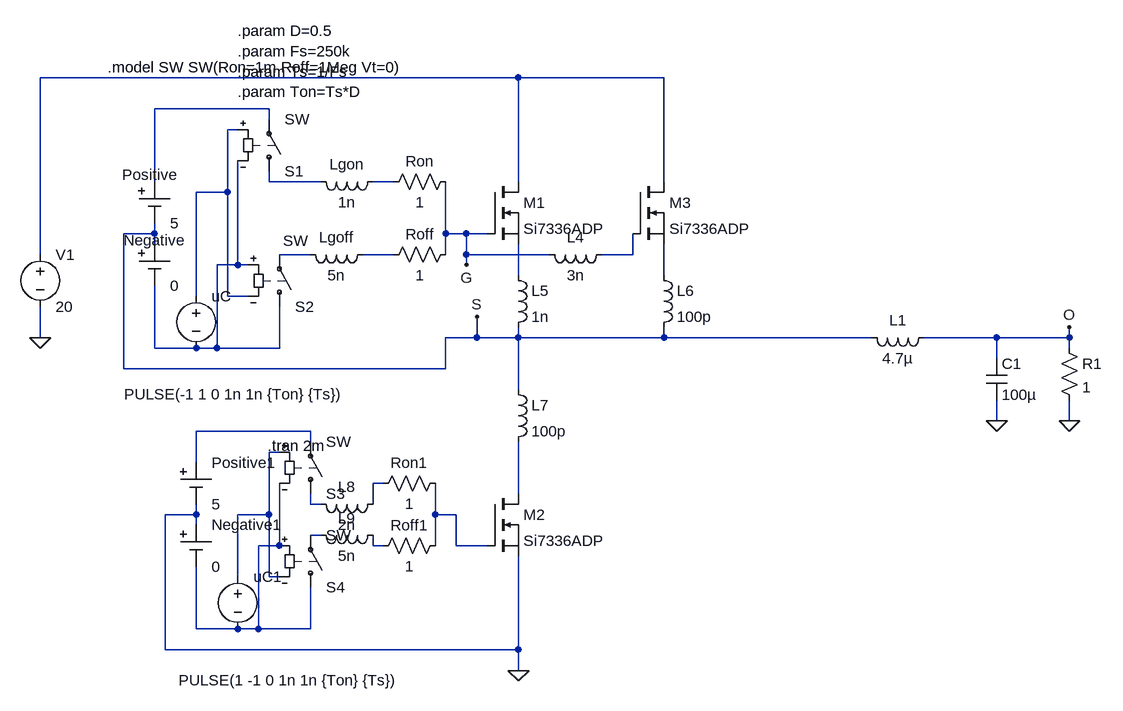
[diagram p0: schematic ActiveTurnOnOff.asc]
ActiveTurnOnOff.asc, the LTspice schematic file:
Version 4
SHEET 1 1032 768
WIRE 128 -176 -608 -176
WIRE 352 -176 128 -176
WIRE -256 -128 -432 -128
WIRE -256 -112 -256 -128
WIRE -304 -96 -320 -96
WIRE -432 -16 -432 -128
WIRE -256 -16 -256 -32
WIRE -176 -16 -256 -16
WIRE -64 -16 -96 -16
WIRE 128 -16 128 -176
WIRE 352 -16 352 -176
WIRE -320 0 -320 -96
WIRE -320 0 -368 0
WIRE -432 64 -432 48
WIRE -432 64 -480 64
WIRE 16 64 16 -16
WIRE 48 64 16 64
WIRE 80 64 48 64
WIRE -432 80 -432 64
WIRE -608 96 -608 -176
WIRE -192 96 -240 96
WIRE -64 96 -112 96
WIRE 16 96 16 64
WIRE 48 96 48 64
WIRE 176 96 48 96
WIRE 304 96 304 64
WIRE 304 96 256 96
WIRE -304 112 -304 -48
WIRE -304 112 -336 112
WIRE -288 112 -304 112
WIRE 48 112 48 96
WIRE 128 128 128 80
WIRE 352 128 352 80
WIRE -368 160 -368 0
WIRE -320 160 -320 0
WIRE -288 160 -320 160
WIRE -608 224 -608 176
WIRE 64 224 64 192
WIRE 64 224 16 224
WIRE 128 224 128 208
WIRE 128 224 64 224
WIRE 352 224 352 208
WIRE 352 224 128 224
WIRE 672 224 352 224
WIRE 864 224 752 224
WIRE 976 224 976 208
WIRE 976 224 864 224
WIRE -432 240 -432 144
WIRE -368 240 -432 240
WIRE -336 240 -336 112
WIRE -336 240 -368 240
WIRE -240 240 -240 176
WIRE -240 240 -336 240
WIRE 976 240 976 224
WIRE 864 256 864 224
WIRE -480 272 -480 64
WIRE 16 272 16 224
WIRE 16 272 -480 272
WIRE 128 304 128 224
WIRE 864 352 864 320
WIRE 976 352 976 320
WIRE -192 368 -368 368
WIRE -192 384 -192 368
WIRE -240 400 -256 400
WIRE -368 416 -368 368
WIRE -80 448 -96 448
WIRE 128 464 128 384
WIRE -192 480 -192 464
WIRE -176 480 -192 480
WIRE -96 480 -96 448
WIRE -368 496 -368 480
WIRE -368 496 -416 496
WIRE -256 496 -256 400
WIRE -256 496 -304 496
WIRE 0 496 0 448
WIRE 32 496 0 496
WIRE -368 512 -368 496
WIRE -176 528 -192 528
WIRE -240 544 -240 448
WIRE -240 544 -272 544
WIRE -96 544 -96 528
WIRE -80 544 -96 544
WIRE 0 544 0 496
WIRE 32 544 32 496
WIRE 80 544 32 544
WIRE -304 592 -304 496
WIRE -256 592 -256 496
WIRE -240 592 -256 592
WIRE -368 672 -368 576
WIRE -304 672 -368 672
WIRE -272 672 -272 544
WIRE -272 672 -304 672
WIRE -192 672 -192 608
WIRE -192 672 -272 672
WIRE -416 704 -416 496
WIRE 128 704 128 560
WIRE 128 704 -416 704
WIRE 128 736 128 704
FLAG 976 352 0
FLAG -608 224 0
FLAG 864 352 0
FLAG 976 208 O
FLAG 64 192 S
FLAG 48 112 G
FLAG 128 736 0
SYMBOL voltage -608 80 R0
SYMATTR InstName V1
SYMATTR Value 20
SYMBOL ind 768 208 R90
WINDOW 0 5 56 VBottom 2
WINDOW 3 32 56 VTop 2
SYMATTR InstName L1
SYMATTR Value 4.7µ
SYMBOL cap 848 256 R0
SYMATTR InstName C1
SYMATTR Value 100µ
SYMBOL res 960 224 R0
SYMATTR InstName R1
SYMATTR Value 1
SYMBOL nmos 80 -16 R0
SYMATTR InstName M1
SYMATTR Value Si7336ADP
SYMBOL voltage -368 144 R0
WINDOW 3 -111 167 Left 2
WINDOW 123 0 0 Left 0
WINDOW 39 0 0 Left 0
SYMATTR InstName uC
SYMATTR Value PULSE(-1 1 0 1n 1n {Ton} {Ts})
SYMBOL res -80 112 R270
WINDOW 0 32 56 VTop 2
WINDOW 3 0 56 VBottom 2
SYMATTR InstName Roff
SYMATTR Value 1
SYMBOL res -80 0 R270
WINDOW 0 32 56 VTop 2
WINDOW 3 0 56 VBottom 2
SYMATTR InstName Ron
SYMATTR Value 1
SYMBOL Misc\\cell -432 -16 R0
WINDOW 0 -50 -11 Left 2
SYMATTR InstName Positive
SYMATTR Value 5
SYMBOL Misc\\cell -432 80 R0
WINDOW 0 -48 -6 Left 2
SYMATTR InstName Negative
SYMATTR Value 0
SYMBOL sw -256 -16 M180
SYMATTR InstName S1
SYMBOL sw -240 192 M180
WINDOW 3 6 117 Left 2
SYMATTR InstName S2
SYMBOL voltage -304 576 R0
WINDOW 3 -91 175 Left 2
WINDOW 123 0 0 Left 0
WINDOW 39 0 0 Left 0
SYMATTR InstName uC1
SYMATTR Value PULSE(1 -1 0 1n 1n {Ton} {Ts})
SYMBOL res -96 560 R270
WINDOW 0 32 56 VTop 2
WINDOW 3 0 56 VBottom 2
SYMATTR InstName Roff1
SYMATTR Value 1
SYMBOL res -96 464 R270
WINDOW 0 32 56 VTop 2
WINDOW 3 0 56 VBottom 2
SYMATTR InstName Ron1
SYMATTR Value 1
SYMBOL Misc\\cell -368 416 R0
SYMATTR InstName Positive1
SYMATTR Value 5
SYMBOL Misc\\cell -368 512 R0
SYMATTR InstName Negative1
SYMATTR Value 0
SYMBOL sw -192 480 M180
SYMATTR InstName S3
SYMBOL sw -192 624 M180
SYMATTR InstName S4
SYMBOL nmos 80 464 R0
SYMATTR InstName M2
SYMATTR Value Si7336ADP
SYMBOL nmos 304 -16 R0
SYMATTR InstName M3
SYMATTR Value Si7336ADP
SYMBOL ind -80 -32 R90
WINDOW 0 5 56 VBottom 2
WINDOW 3 32 56 VTop 2
SYMATTR InstName Lgon
SYMATTR Value 1n
SYMBOL ind -96 80 R90
WINDOW 0 5 56 VBottom 2
WINDOW 3 32 56 VTop 2
SYMATTR InstName Lgoff
SYMATTR Value 5n
SYMBOL ind 272 80 R90
WINDOW 0 5 56 VBottom 2
WINDOW 3 32 56 VTop 2
SYMATTR InstName L4
SYMATTR Value 3n
SYMBOL ind 112 112 R0
SYMATTR InstName L5
SYMATTR Value 1n
SYMBOL ind 336 112 R0
SYMATTR InstName L6
SYMATTR Value 100p
SYMBOL ind 112 288 R0
SYMATTR InstName L7
SYMATTR Value 100p
SYMBOL ind -80 464 R90
WINDOW 0 5 56 VBottom 2
WINDOW 3 32 56 VTop 2
SYMATTR InstName L8
SYMATTR Value 2n
SYMBOL ind -80 512 R90
WINDOW 0 5 56 VBottom 2
WINDOW 3 32 56 VTop 2
SYMATTR InstName L9
SYMATTR Value 5n
TEXT -304 -248 Left 2 !.param D=0.5\n.param Fs=250k\n.param Ts=1/Fs\n.param Ton=Ts*D
TEXT -258 390 Left 2 !.tran 2m
TEXT -504 -192 Left 2 !.model SW SW(Ron=1m Roff=1Meg Vt=0)

The netlist it stands for:
* ActiveTurnOnOff.asc
V1 N001 0 20
L1 O S 4.7µ
C1 O 0 100µ
R1 O 0 1
M1 N001 G N010 N010 Si7336ADP
V§uC N003 N009 PULSE(-1 1 0 1n 1n {Ton} {Ts})
Roff N007 G 1
Ron N005 G 1
V§Positive N002 S 5
V§Negative S N009 0
S1 N004 N002 N003 N009 SW
S2 N009 N006 N009 N003 SW
V§uC1 N013 N019 PULSE(1 -1 0 1n 1n {Ton} {Ts})
Roff1 N020 N017 1
Ron1 N014 N017 1
V§Positive1 N012 0 5
V§Negative1 0 N019 0
S3 N016 N012 N013 N019 SW
S4 N019 N018 N019 N013 SW
M2 N015 N017 0 0 Si7336ADP
M3 N001 N008 N011 N011 Si7336ADP
Lgon N005 N004 1n
Lgoff N007 N006 5n
L4 N008 G 3n
L5 N010 S 1n
L6 N011 S 100p
L7 S N015 100p
L8 N014 N016 2n
L9 N020 N018 5n
.model NMOS NMOS
.model PMOS PMOS
.lib standard.mos
.param D=0.5
.param Fs=250k
.param Ts=1/Fs
.param Ton=Ts*D
.tran 2m
.model SW SW(Ron=1m Roff=1Meg Vt=0)
.backanno
.end